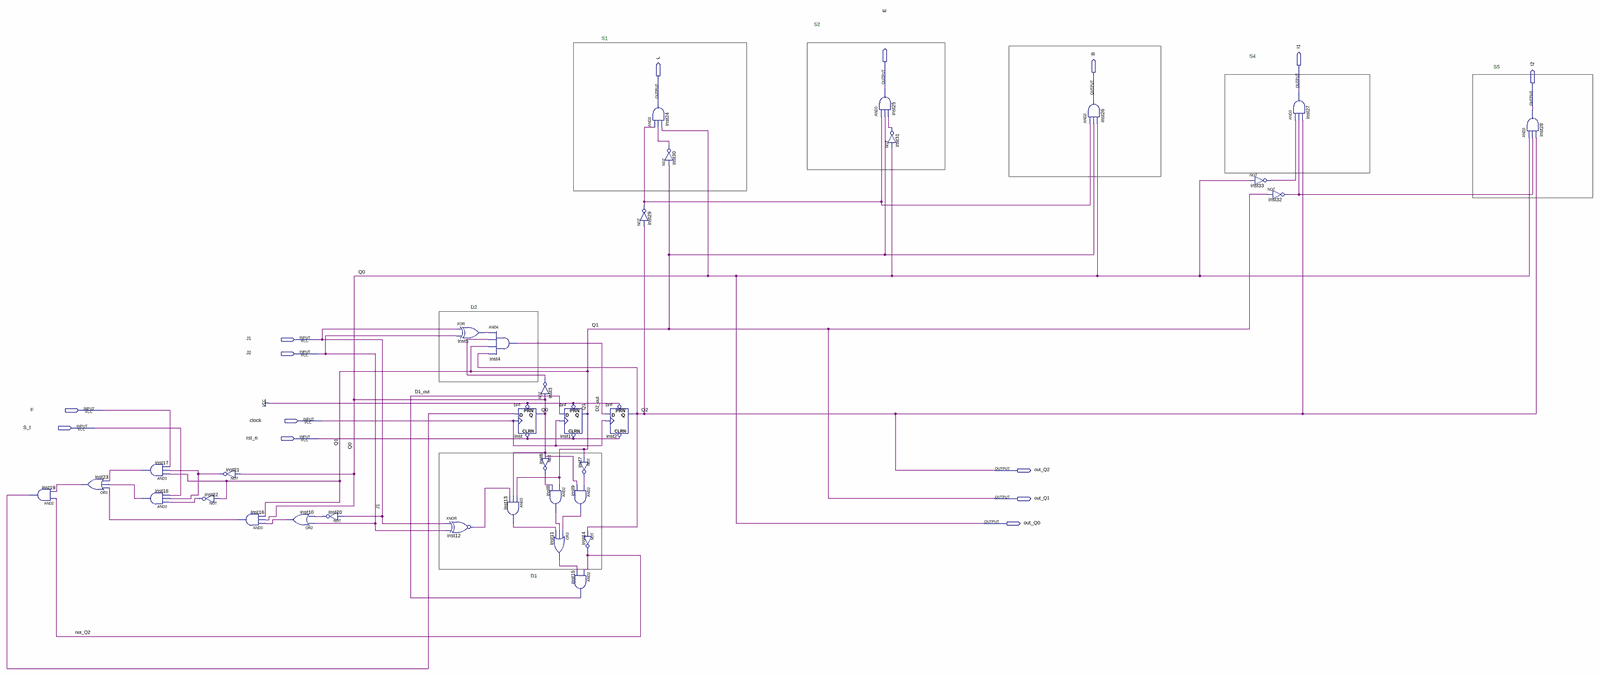
[diagram p0: schematic sheet, whole]
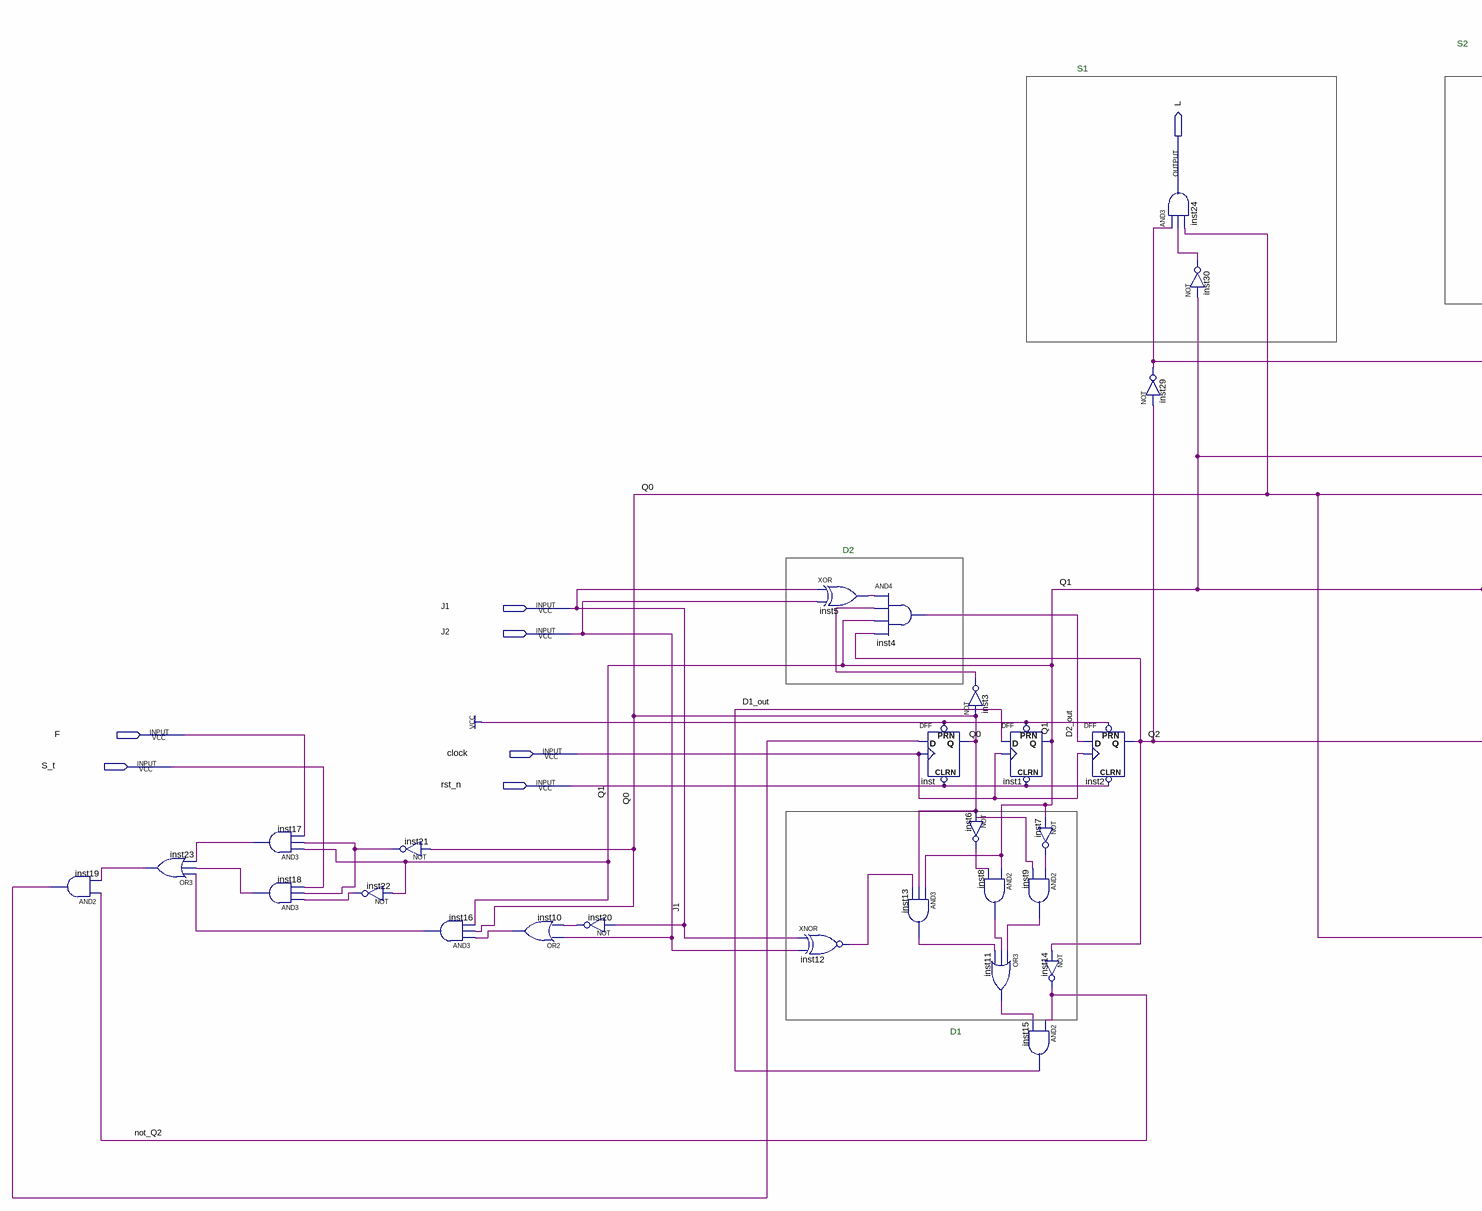
[diagram p1: schematic sheet, left part]
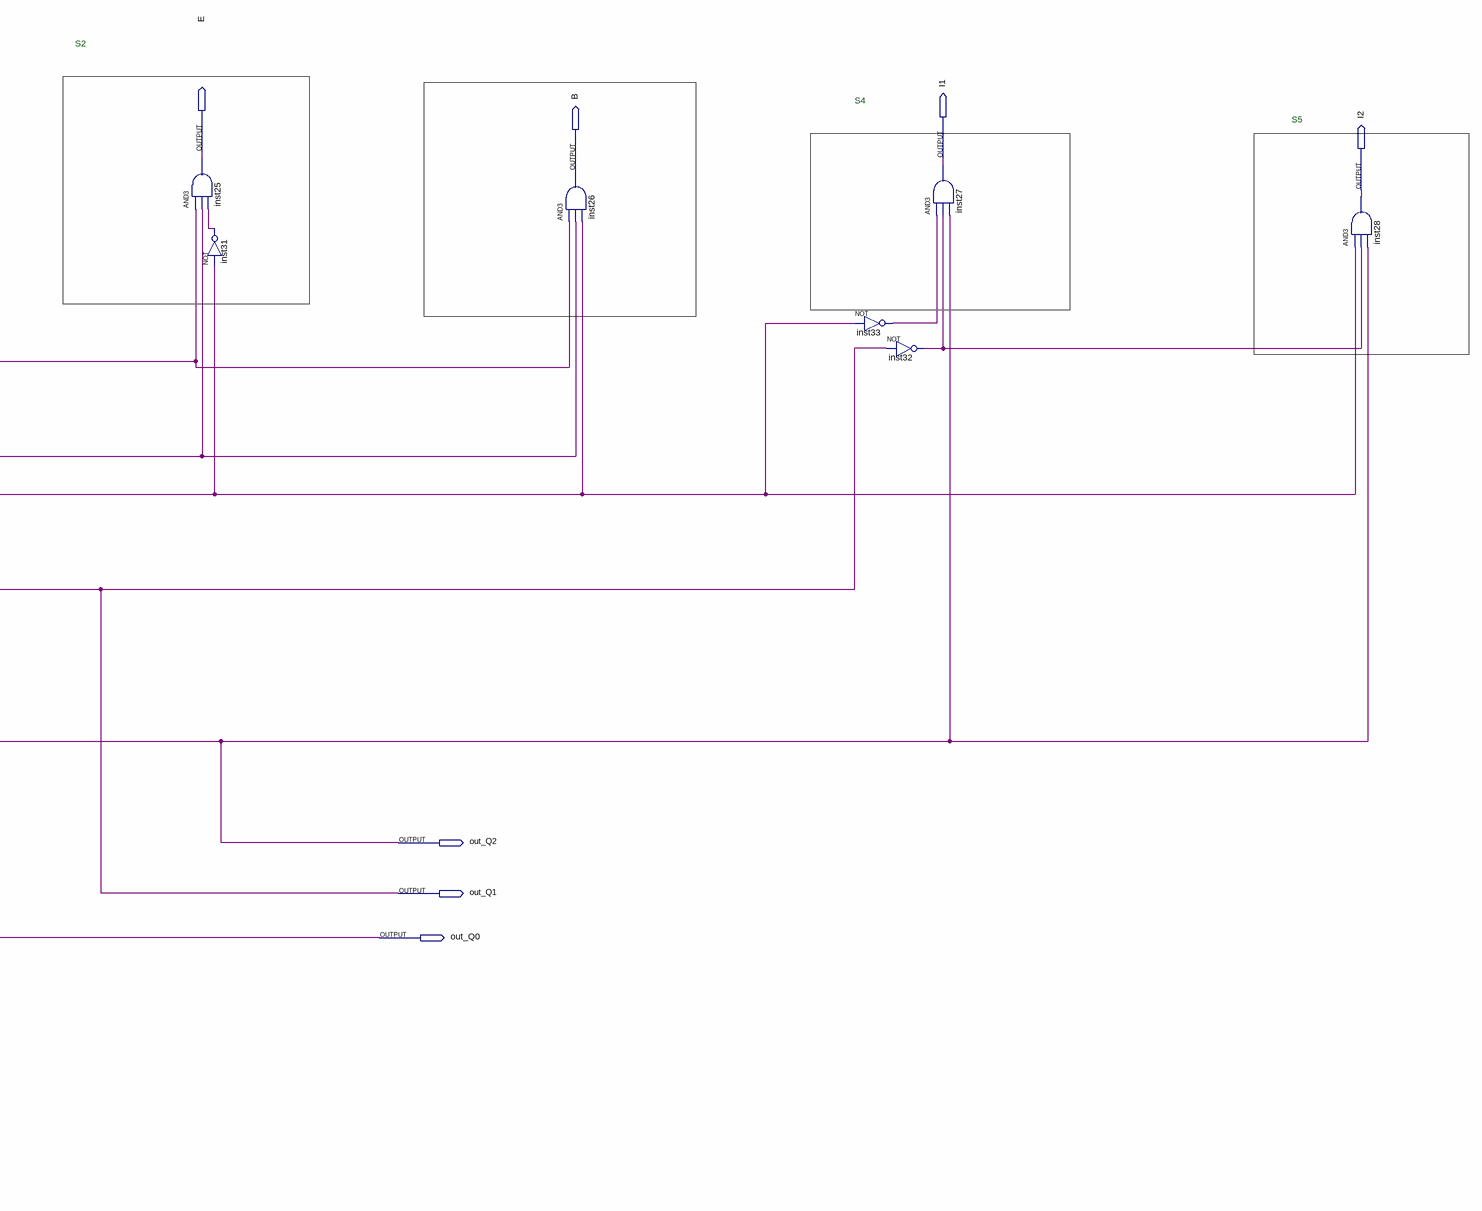
[diagram p2: schematic sheet, right part]
// Quartus schematic FSM.bdf as structural Verilog: 34 symbols, 14 pins
module FSM (
  input  J1,
  input  J2,
  input  F,
  input  clock,
  input  S_t,
  input  rst_n,
  output E,
  output I1,
  output B,
  output L,
  output I2,
  output out_Q2,
  output out_Q1,
  output out_Q0
);

  wire D1_out, D2_out, inst3_out, inst5_out, inst6_out, inst7_out, inst8_out, inst9_out, inst10_out,
       inst11_out, inst12_out, inst13_out, inst16_out, inst17_out, inst18_out, inst19_out, inst20_out,
       inst21_out, inst22_out, inst23_out, inst29_out, inst30_out, inst31_out, inst32_out, inst33_out, not_Q2;

  and inst19 (inst19_out, not_Q2, inst23_out);
  or inst23 (inst23_out, inst16_out, inst18_out, inst17_out);
  and inst17 (inst17_out, out_Q1, inst21_out, F);
  and inst18 (inst18_out, inst22_out, inst21_out, S_t);
  not inst21 (inst21_out, out_Q0);
  not inst22 (inst22_out, out_Q1);
  and inst16 (inst16_out, inst10_out, out_Q0, out_Q1);
  or inst10 (inst10_out, J2, inst20_out);
  not inst20 (inst20_out, J1);
  xnor inst12 (inst12_out, J1, J2);
  xor inst5 (inst5_out, J1, J2);
  and inst4 (D2_out, inst5_out, inst3_out, out_Q1, out_Q2);
  and inst13 (inst13_out, out_Q1, out_Q0, inst12_out);
  DFF inst (.CLRN(rst_n), .CLK(clock), .D(inst19_out), .PRN(1'b1), .Q(out_Q0));
  not inst3 (inst3_out, out_Q0);
  DFF inst1 (.CLRN(rst_n), .CLK(clock), .D(D1_out), .PRN(1'b1), .Q(out_Q1));
  not inst6 (inst6_out, out_Q0);
  and inst8 (inst8_out, out_Q1, inst6_out);
  or inst11 (inst11_out, inst9_out, inst8_out, inst13_out);
  not inst7 (inst7_out, out_Q1);
  and inst9 (inst9_out, inst7_out, out_Q0);
  not inst14 (not_Q2, out_Q2);
  and inst15 (D1_out, not_Q2, inst11_out);
  DFF inst2 (.CLRN(rst_n), .CLK(clock), .D(D2_out), .PRN(1'b1), .Q(out_Q2));
  not inst29 (inst29_out, out_Q2);
  and inst24 (L, inst29_out, inst30_out, out_Q0);
  not inst30 (inst30_out, out_Q1);
  and inst25 (E, inst29_out, out_Q1, inst31_out);
  not inst31 (inst31_out, out_Q0);
  and inst26 (B, inst29_out, out_Q1, out_Q0);
  not inst33 (inst33_out, out_Q0);
  not inst32 (inst32_out, out_Q1);
  and inst27 (I1, inst33_out, inst32_out, out_Q2);
  and inst28 (I2, out_Q0, inst32_out, out_Q2);

  // Other names for the same wires on the sheet: Q0 = out_Q0; Q1 = out_Q1; Q2 = out_Q2

  // Notes on the sheet:
  //   S2
  //   S1
  //   S4
  //   S5
  //   D2
  //   D1
endmodule
